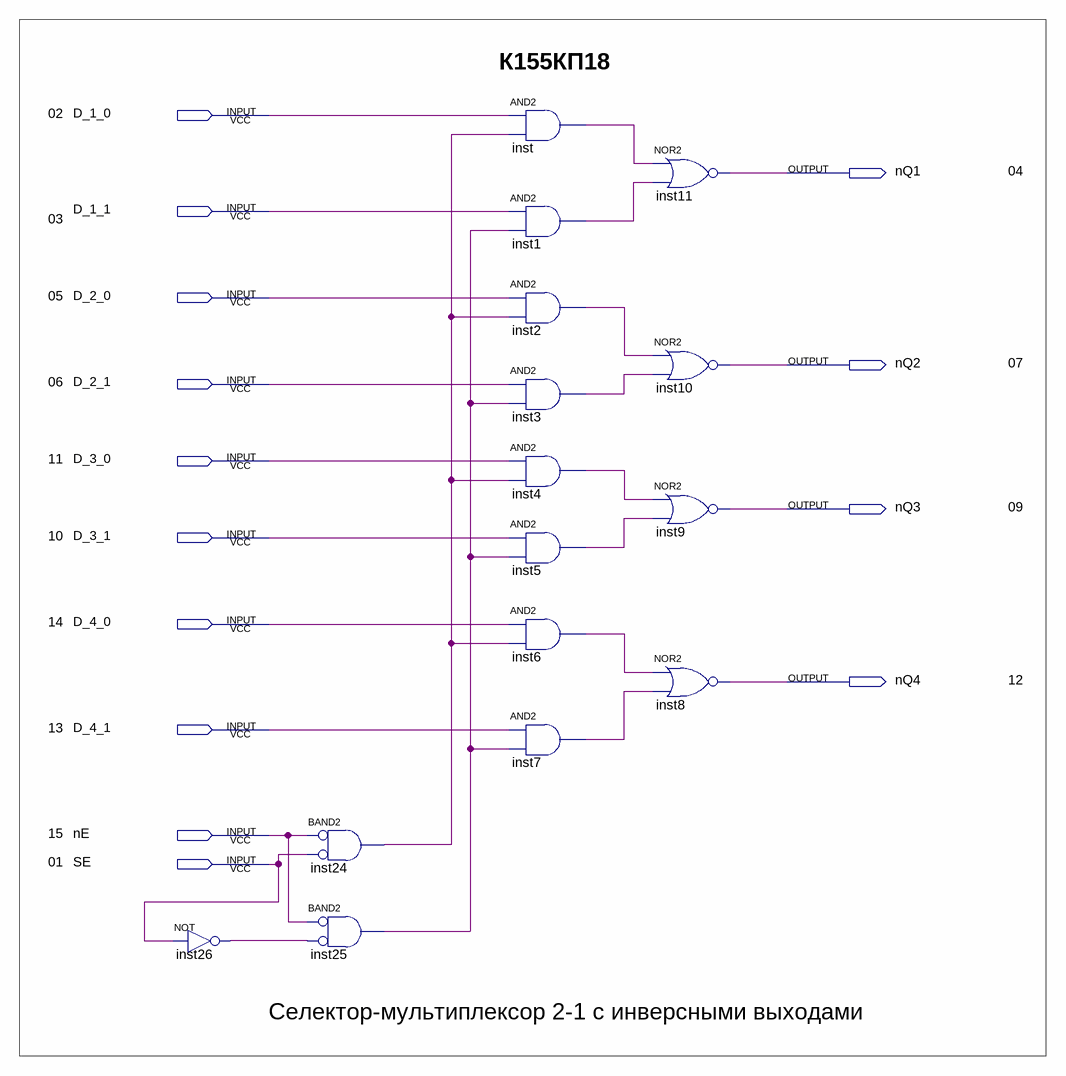
[diagram p0: schematic sheet]
// Quartus schematic K155KP18.bdf as structural Verilog: 15 symbols, 14 pins
module K155KP18 (
  input  D_1_0,
  input  D_1_1,
  input  D_2_0,
  input  D_2_1,
  input  D_3_0,
  input  D_3_1,
  input  D_4_0,
  input  D_4_1,
  input  nE,
  input  SE,
  output nQ1,
  output nQ2,
  output nQ3,
  output nQ4
);

  wire inst1_out, inst2_out, inst3_out, inst4_out, inst5_out, inst6_out, inst7_out, inst24_out, inst25_out,
       inst26_out, inst_out;

  not inst26 (inst26_out, SE);
  and inst24 (inst24_out, ~nE, ~SE);  // BAND2
  and inst25 (inst25_out, ~nE, ~inst26_out);  // BAND2
  and inst (inst_out, D_1_0, inst24_out);
  and inst1 (inst1_out, D_1_1, inst25_out);
  and inst2 (inst2_out, D_2_0, inst24_out);
  and inst3 (inst3_out, D_2_1, inst25_out);
  and inst4 (inst4_out, D_3_0, inst24_out);
  and inst5 (inst5_out, D_3_1, inst25_out);
  and inst6 (inst6_out, D_4_0, inst24_out);
  and inst7 (inst7_out, D_4_1, inst25_out);
  nor inst11 (nQ1, inst_out, inst1_out);
  nor inst10 (nQ2, inst2_out, inst3_out);
  nor inst9 (nQ3, inst4_out, inst5_out);
  nor inst8 (nQ4, inst6_out, inst7_out);

  // Notes on the sheet:
  //   К155КП18
  //   02
  //   04
  //   03
  //   05
  //   07
  //   06
  //   11
  //   09
  //   10
  //   14
  //   12
  //   13
  //   15
  //   01
  //   Селектор-мультиплексор 2-1 с инверсными выходами
endmodule
